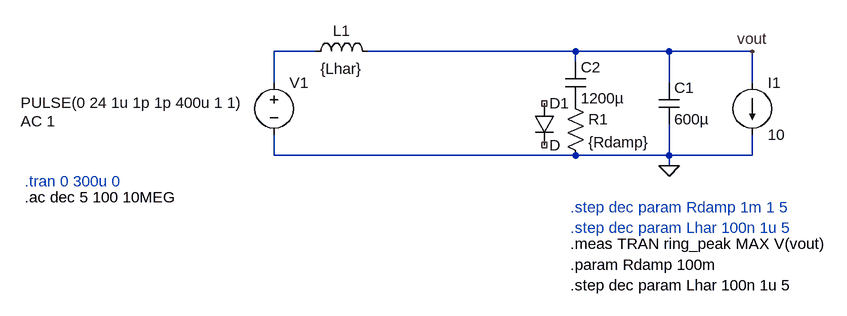
[diagram p0: schematic filter_demo.asc]
filter_demo.asc, the LTspice schematic file:
Version 4.1
SHEET 1 988 680
WIRE 160 64 96 64
WIRE 560 64 240 64
WIRE 704 64 560 64
WIRE 832 64 704 64
WIRE 560 80 560 64
WIRE 96 112 96 64
WIRE 704 112 704 64
WIRE 832 112 832 64
WIRE 96 224 96 192
WIRE 560 224 96 224
WIRE 704 224 704 176
WIRE 704 224 560 224
WIRE 832 224 832 192
WIRE 832 224 704 224
WIRE 704 240 704 224
FLAG 704 240 0
FLAG 832 64 vout
SYMBOL voltage 96 96 R0
WINDOW 3 -390 47 Left 2
WINDOW 123 -390 75 Left 2
WINDOW 39 0 0 Left 0
SYMATTR InstName V1
SYMATTR Value PULSE(0 24 1u 1p 1p 400u 1 1)
SYMATTR Value2 AC 1
SYMBOL ind 144 80 R270
WINDOW 0 32 56 VTop 2
WINDOW 3 5 56 VBottom 2
SYMATTR InstName L1
SYMATTR Value {Lhar}
SYMATTR SpiceLine Rser=20m
SYMBOL cap 688 112 R0
SYMATTR InstName C1
SYMATTR Value 600µ
SYMBOL current 832 112 R0
WINDOW 123 0 0 Left 0
WINDOW 39 0 0 Left 0
SYMATTR InstName I1
SYMATTR Value 10
SYMBOL cap 544 80 R0
SYMATTR InstName C2
SYMATTR Value 1200µ
SYMBOL res 544 128 R0
SYMATTR InstName R1
SYMATTR Value {Rdamp}
SYMBOL diode 496 144 R0
SYMATTR InstName D1
TEXT -288 264 Left 2 ;.tran 0 300u 0
TEXT 552 304 Left 2 ;.step dec param Rdamp 1m 1 5\n.step dec param Lhar 100n 1u 5
TEXT 552 360 Left 2 !.meas TRAN ring_peak MAX V(vout)
TEXT 552 392 Left 2 !.param Rdamp 100m
TEXT 552 424 Left 2 !.step dec param Lhar 100n 1u 5
TEXT -288 288 Left 2 !.ac dec 5 100 10MEG

The netlist it stands for:
* filter_demo.asc
V1 N001 0 PULSE(0 24 1u 1p 1p 400u 1 1) AC 1
L1 N001 vout {Lhar} Rser=20m
C1 vout 0 600µ
I1 vout 0 10
C2 vout P001 1200µ
R1 P001 0 {Rdamp}
D1 NC_01 NC_02 D
.model D D
.lib standard.dio
* .tran 0 300u 0
* .step dec param Rdamp 1m 1 5
* .step dec param Lhar 100n 1u 5
.meas TRAN ring_peak MAX V(vout)
.param Rdamp 100m
.step dec param Lhar 100n 1u 5
.ac dec 5 100 10MEG
.backanno
.end